# EAGLE design RPiCANShield (EAGLE 6.5.0)
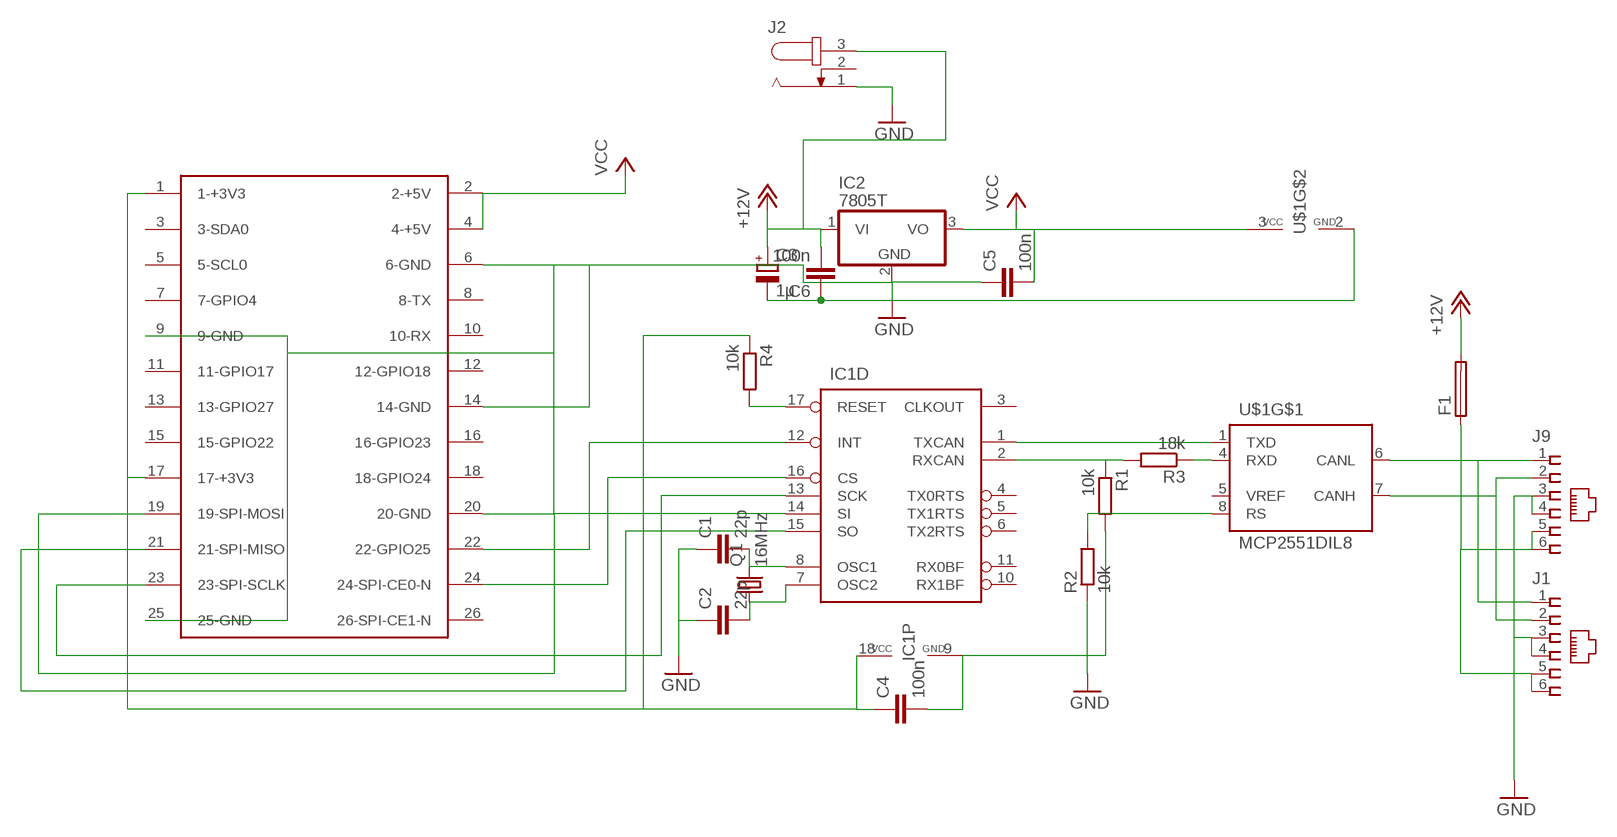
[diagram p0: schematic, sheet 1]

## Parts
C1  22p  C-EU025-024X044  [C025-024X044]
C2  22p  C-EU025-024X044  [C025-024X044]
C3  1µ  CPOL-EUE2-5  [E2-5]
C4  100n  C-EU050-024X044  [C050-024X044]
C5  100n  C-EU050-024X044  [C050-024X044]
C6  100n  C-EU050-024X044  [C050-024X044]
F1  PICOFUSE  [PICOFUSE]
IC1  MCP2515P  [DIL18]
IC2  7805T  [TO220H]
J1  520250-3  [520250-3]
J2  JACK-PLUG0  [SPC4077]
J9  520250-3  [520250-3]
Q1  16MHz  CRYSTALHC18U-V  [HC18U-V]
R1  10k  R-EU_0207/7  [0207/7]
R2  10k  R-EU_0207/7  [0207/7]
R3  18k  R-EU_0207/7  [0207/7]
R4  10k  R-EU_0204/5  [0204/5]
U$1  MCP2551DIL8  [DIL08]
U$2  RASPBERRY-PI  [RASPBERRY-PI]

## Nets
+12V: C3.+ C6.2 F1.2 IC2.1(VI) J2.3
GND: C1.1 C2.1 C3.- C4.2 C5.1 C6.1 IC1.9(P:GND) IC2.2(GND) J1.3 J1.4 J2.1 J9.3 J9.4 R1.2 R2.1 U$1.2(GND) U$2.6(6-GND) U$2.9(9-GND) U$2.14(14-GND) U$2.20(20-GND) U$2.25(25-GND)
N$1: IC1.1(D:TXCAN) U$1.1(TXD)
N$2: R3.1 U$1.4(RXD)
N$3: J1.1 J9.1 U$1.6(CANL)
N$4: J1.2 J9.2 U$1.7(CANH)
N$5: F1.1 J1.5 J1.6 J9.5 J9.6
N$6: IC1.2(D:RXCAN) R1.1 R3.2
N$7: R2.2 U$1.8(RS)
N$8: C4.1 IC1.18(P:VCC) R4.1 U$2.1(1-+3V3) U$2.17(17-+3V3)
N$10: IC1.17(D:RESET) R4.2
N$11: IC1.16(D:CS) U$2.24(24-SPI-CE0-N)
N$12: IC1.13(D:SCK) U$2.23(23-SPI-SCLK)
N$13: IC1.14(D:SI) U$2.19(19-SPI-MOSI)
N$14: IC1.12(D:INT) U$2.22(22-GPIO25)
N$16: IC1.15(D:SO) U$2.21(21-SPI-MISO)
N$22: C1.2 IC1.8(D:OSC1) Q1.2
N$23: C2.2 IC1.7(D:OSC2) Q1.1
VCC: C5.2 IC2.3(VO) U$1.3(VCC) U$2.2(2-+5V) U$2.4(4-+5V)
Unconnected: IC1.3(D:CLKOUT) IC1.4(D:TX0RTS) IC1.5(D:TX1RTS) IC1.6(D:TX2RTS) IC1.10(D:RX1BF) IC1.11(D:RX0BF) J2.2 U$1.5(VREF) U$2.3(3-SDA0) U$2.5(5-SCL0) U$2.7(7-GPIO4) U$2.8(8-TX) U$2.10(10-RX) U$2.11(11-GPIO17) U$2.12(12-GPIO18) U$2.13(13-GPIO27) U$2.15(15-GPIO22) U$2.16(16-GPIO23) U$2.18(18-GPIO24) U$2.26(26-SPI-CE1-N)

## Library data of the parts
C1 C2 = resistor:C-EU: CAPACITOR, European symbol
C3 = resistor:CPOL-EU: POLARIZED CAPACITOR, European symbol
C4-C6 = rcl:C-EU: CAPACITOR, European symbol
F1 = fuse:PICOFUSE: PICOFUSE 19275, Wickmann; OC_FARNELL: unknown; OC_NEWARK: unknown
IC1 = can:MCP2515: MC2515 Stand-Alone CAN Controller With SPI Interface, Microchip
IC2 = linear:78*: Positive VOLTAGE REGULATOR Source: http://cache.national.com/ds/LM/LM78L05.pdf http://www.fairchildsemi.com/ds/LM/LM7805.pdf
J1 J9 = con-amp:520250-3: AMP connector
J2 = con-jack:JACK-PLUG: DC POWER JACK Power Jack, DC, Right Angle, Through Hole, Rated 5A at 16VDC, PC Terminals Distributor: Farnell (www.Farnell.de) Drawing: 84N1161.pdf / 84N1162.pdf Manufacturer: SPC Technology (www.spctechnology.com) Type: SPC4077 / SPC 4078; OC_FARNELL: unknown; OC_NEWARK: unknown
Q1 = crystal:CRYSTAL: CRYSTAL; OC_FARNELL: unknown; OC_NEWARK: unknown
R1-R4 = resistor:R-EU_: RESISTOR, European symbol
U$1 = can:MCP2551: CAN Tranceiver Microchip
U$2 = RaspberryPi:RASPBERRY-PI: Raspberry Pi Board <http://www.raspberrypi.org/> Jacques Lagnel V1.0 (beta) 2012 Board dimension: Forum 3D model <http://www.raspberrypi.org/forum/general-discussion/mechanical-profile-3d-models?value=3d%20model&type=1&include=1&search=1&ret=all> The GPIO Connector (P1): http://elinux.org/RPi_Low-level_peripherals

## Board
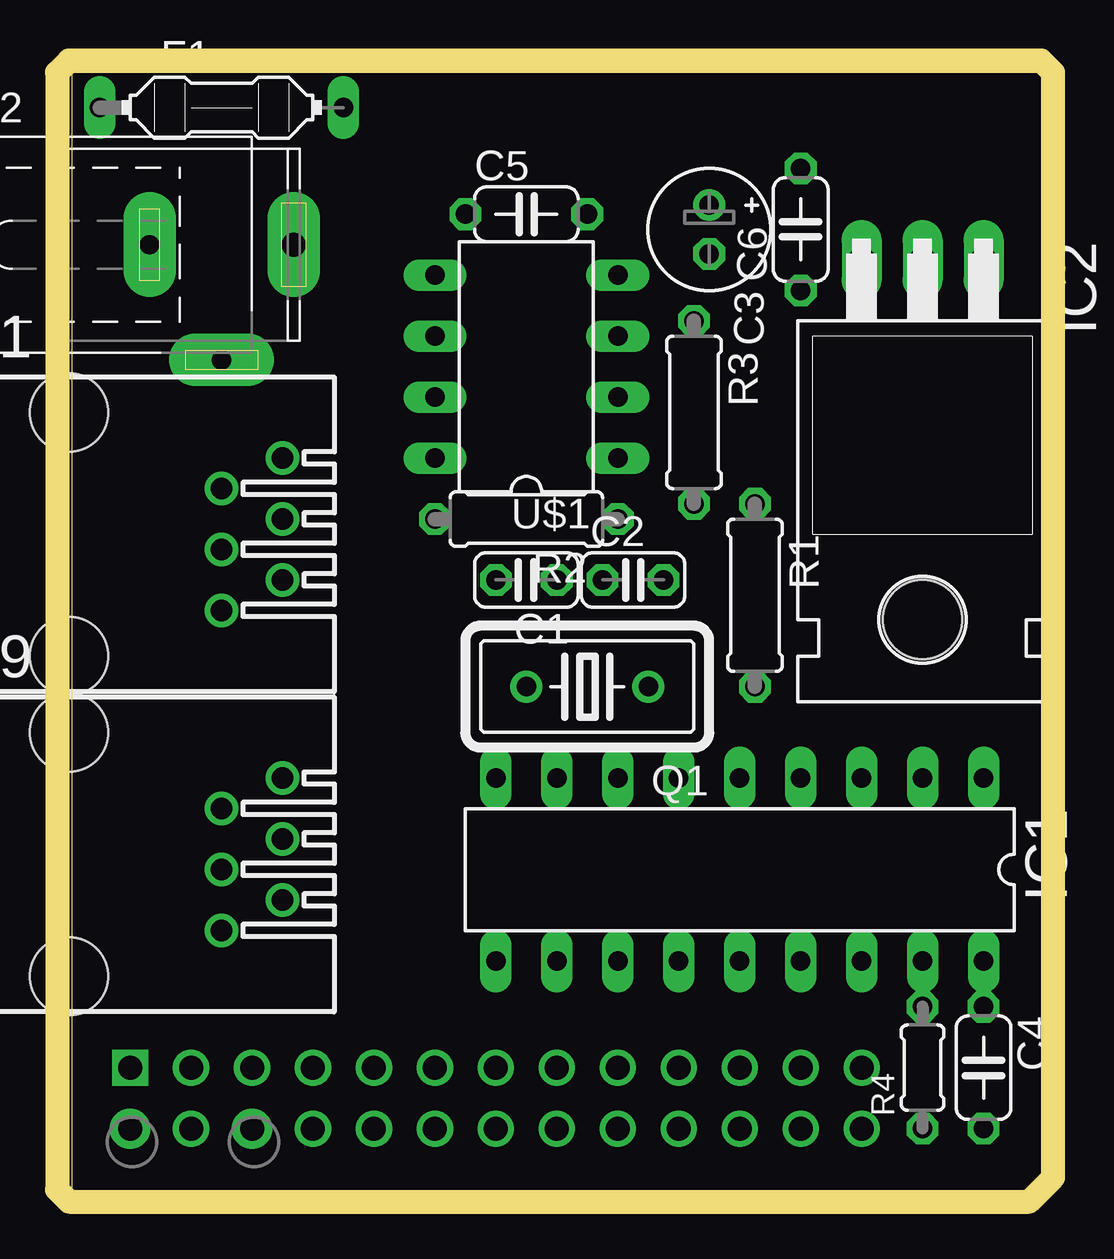
[diagram p1: board, top side]
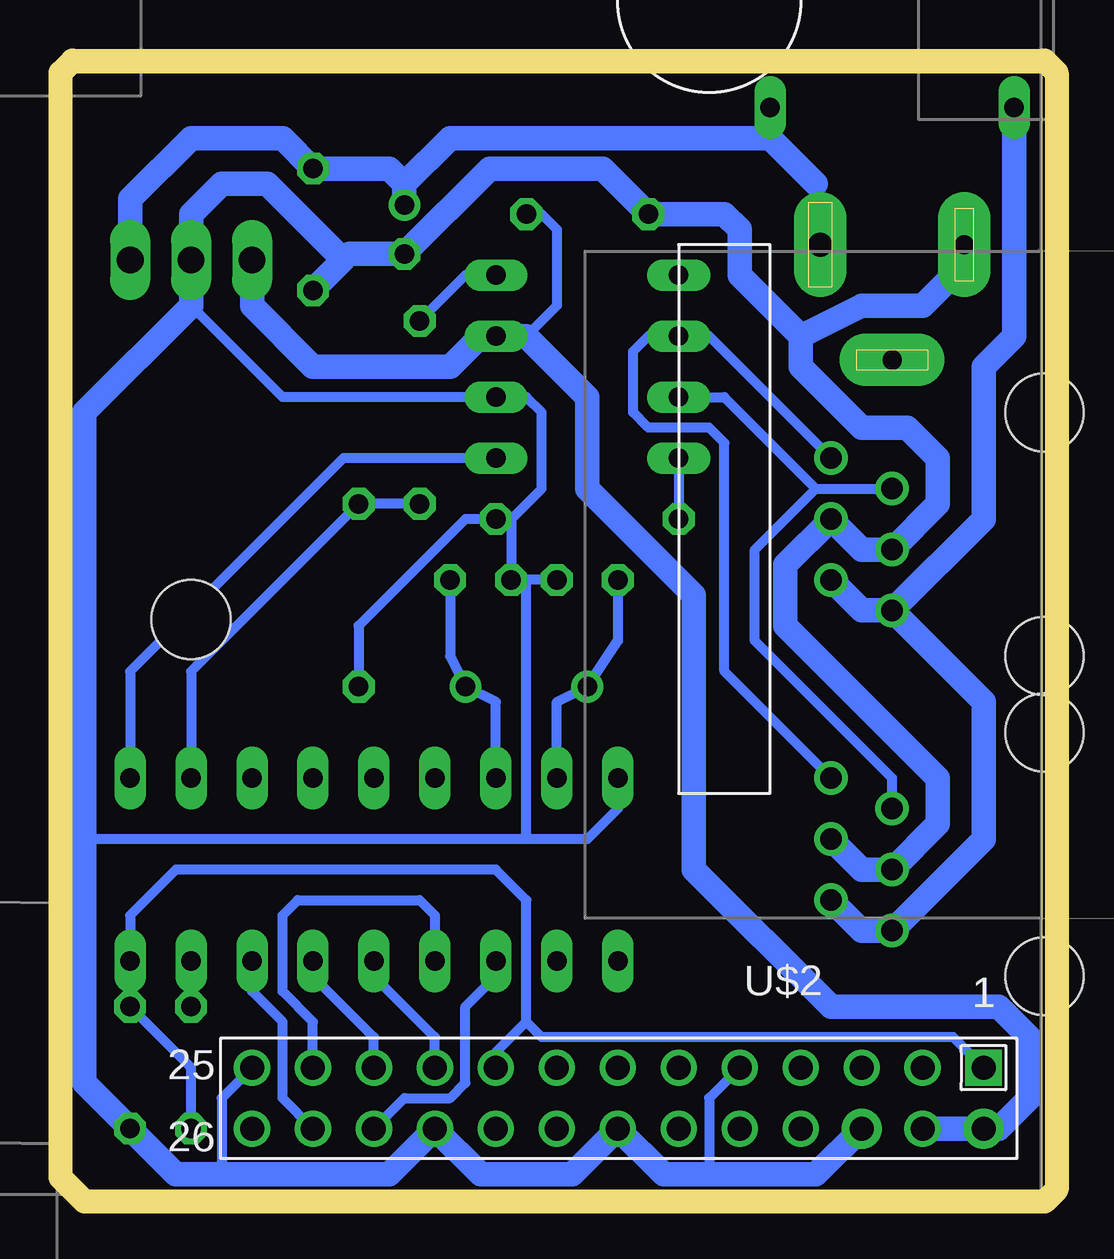
[diagram p2: board, bottom side, seen from below]

Size 40.5 x 46.81 mm. Coordinates in mm from the lower left corner, seen from the top.
Outline: 0,0 40.5,0 40.5,46.81 0,46.81 0,0
Copper layers (1*16): Top 0.035mm / dielectric 1.5mm / Bottom 0.035mm
Design rules "default *": minimum track width 10mil, minimum drill 0.6mm, track to track 8mil, track to pad 8mil, pad to pad 8mil, via to via 8mil, smd to smd 8mil, copper to edge 0mil, drill to drill 8mil, minimum pad ring 10mil, minimum via ring 8mil, stop-mask expansion 4mil, vias tented up to drill 0mil, thermal gap 10mil
Milling: 8 lines

### Footprints (pad centres in the part's own frame; a part is rotated, then mirrored left to right if it is on the bottom)
C025-024X044 = drill 0.813 octagon: 1 -1.27,0; 2 1.27,0
E2-5 = drill 0.813 pad 1.27: + -1.016,0 | drill 0.813 pad 1.27 octagon: - 1.016,0
C050-024X044 = drill 0.813 octagon: 1 -2.54,0; 2 2.54,0
PICOFUSE = drill 0.813 long: 1 -5.08,0; 2 5.08,0
DIL18 = drill 0.813 long: 1 -10.16,-3.81; 2 -7.62,-3.81; 3 -5.08,-3.81; 4 -2.54,-3.81; 5 0,-3.81; 6 2.54,-3.81; 7 5.08,-3.81; 8 7.62,-3.81; 9 10.16,-3.81; 10 10.16,3.81; 11 7.62,3.81; 12 5.08,3.81; 13 2.54,3.81; 14 0,3.81; 15 -2.54,3.81; 16 -5.08,3.81; 17 -7.62,3.81; 18 -10.16,3.81
TO220H = drill 1.118 long: 1 -2.54,-10.16; 2 0,-10.16; 3 2.54,-10.16 | hole 3.302: 0,4.826
520250-3 = drill 0.889: 1 -3.175,8.89; 2 -1.905,6.35; 3 -0.635,8.89; 4 0.635,6.35; 5 1.905,8.89; 6 3.175,6.35 | hole 3.251: -5.08,0; 5.08,0
SPC4077 = drill 0.8 pad 2.184 long: 1 -3,0; 2 0,-4.8 | drill 1 pad 2.184 long: 3 3,0
HC18U-V = drill 0.813: 1 -2.54,0; 2 2.54,0
0207/7 = drill 0.813 octagon: 1 -3.81,0; 2 3.81,0
0204/5 = drill 0.813 octagon: 1 -2.54,0; 2 2.54,0
DIL08 = drill 0.813 long: 1 -3.81,-3.81; 2 -1.27,-3.81; 3 1.27,-3.81; 4 3.81,-3.81; 5 3.81,3.81; 6 1.27,3.81; 7 -1.27,3.81; 8 -3.81,3.81
RASPBERRY-PI = drill 1 square: 1 0,0 | drill 1 pad 1.676: 2 0,2.54; 6 5.08,2.54 | drill 1: 3 2.54,0; 4 2.54,2.54; 5 5.08,0; 7 7.62,0; 8 7.62,2.54; 9 10.16,0; 10 10.16,2.54; 11 12.7,0; 12 12.7,2.54; 13 15.24,0; 14 15.24,2.54; 15 17.78,0; 16 17.78,2.54; 17 20.32,0; 18 20.32,2.54; 19 22.86,0; 20 22.86,2.54; 21 25.4,0; 22 25.4,2.54; 23 27.94,0; 24 27.94,2.54; 25 30.48,0; 26 30.48,2.54

### Placement (x,y rotation side)
C1  18.94,25.67 180 top
C2  23.39,25.67 0 top
C3  26.56,40.28 270 top
C4  37.99,5.35 270 top
C5  18.94,40.91 0 top
C6  30.37,40.28 90 top
F1  6.24,45.36 0 top
IC1  27.83,13.61 180 top
IC2  35.45,28.84 180 top
J1  -0.11,27.57 270 top
J2  6.24,39.64 0 top
J9  -0.11,14.24 270 top
Q1  21.48,21.22 180 top
R1  28.46,25.04 270 top
R2  18.94,28.21 180 top
R3  25.93,32.66 270 top
R4  35.45,5.35 90 top
U$1  18.94,34.56 90 top
U$2  2.43,5.35 180 bottom

### Tracks (layer width: path | path; a pad name or v marks a point on that pad's centre or on a via)
+12V
  Bottom 0.406: 9.42,42.18 9.42,39.82 J2.3 | IC2.1 37.99,40.28
  Bottom 1.016: 26.56,42.18 24.66,44.09 11.32,44.09 | 11.32,44.09 9.42,42.18 | C3.+ 26.56,42.18 | 26.56,42.18 27.2,42.82 C6.2 31.64,44.09 35.45,44.09 37.99,41.55 37.99,40.28 | 11.32,44.09 F1.2
GND
  Bottom 0.406: U$2.25 34.18,4.08 34.18,0.91 | C1.1 21.48,25.67 | 21.48,25.67 C2.1 22.12,28.21 | IC1.9 17.67,16.14 18.94,14.88 21.48,14.88 | 21.48,14.88 39.9,14.88 | 21.48,14.88 21.48,25.67 | U$2.9 13.86,4.08 13.86,0.91 | 22.12,28.21 R2.1 24.02,28.21 28.46,23.77 R1.2 | 22.12,28.21 20.84,29.48 20.84,32.66 21.48,33.29 U$1.2 31.64,33.29 35.45,37.1 | 28.85,39.26 29.1,39.01
  Bottom 1.016: J9.3 7.51,13.61 J9.4 4.33,15.51 4.33,17.41 10.69,23.77 10.69,26.3 J1.3 7.51,26.94 J1.4 4.33,28.84 4.33,30.75 5.6,32.02 7.51,32.02 10.05,34.56 10.05,35.83 | U$2.6 9.42,0.91 13.86,0.91 15.77,0.91 U$2.14 19.57,0.91 23.39,0.91 U$2.20 27.2,0.91 34.18,0.91 36.09,0.91 C4.2 39.9,4.71 39.9,14.88 39.9,32.66 35.45,37.1 IC2.2 35.45,40.91 34.18,42.18 32.27,42.18 29.1,39.01 C6.1 | 28.85,39.26 C3.- 23,42.82 18.3,42.82 C5.1 13.23,40.91 12.59,40.28 12.59,38.37 10.05,35.83 | J2.1 3.24,38.83 4.97,37.1 7.51,37.1 10.05,35.83
N$1
  Bottom 0.406: U$1.1 29.1,30.75 37.99,21.86 IC1.1
N$2
  Bottom 0.406: U$1.4 24.02,38.37 R3.1
N$3
  Bottom 0.406: J1.1 13.86,35.83 U$1.6 16.4,35.83 17.04,35.2 17.04,32.66 16.4,32.02 13.86,32.02 13.23,31.38 13.23,21.86 J9.1
N$4
  Bottom 0.406: U$1.7 13.23,33.29 9.42,29.48 | 9.42,29.48 J1.2 | J9.2 6.24,17.41 11.96,23.13 11.96,26.94 9.42,29.48
N$5
  Bottom 1.016: J9.5 7.51,11.06 J9.6 2.43,14.88 2.43,20.59 J1.6 | J1.6 7.51,24.4 J1.5 | F1.1 1.16,35.83 2.43,34.56 2.43,28.21 J1.6
N$6
  Bottom 0.406: R3.2 R1.1 35.45,21.86 IC1.2
N$7
  Bottom 0.406: U$1.8 R2.2
N$8
  Bottom 0.406: U$2.1 3.7,6.62 20.84,6.62 21.48,7.26 | U$2.17 22.75,5.98 21.48,7.26 | 21.48,7.26 21.48,12.33 22.75,13.61 36.09,13.61 37.99,11.7 IC1.18 C4.1 35.45,5.35 R4.1
N$10
  Bottom 0.406: IC1.17 R4.2
N$11
  Bottom 0.406: U$2.24 31.64,4.08 31.64,7.26 32.91,8.53 IC1.16
N$12
  Bottom 0.406: U$2.23 30.37,7.26 31.64,8.53 31.64,11.7 31,12.33 25.93,12.33 25.29,11.7 IC1.13
N$13
  Bottom 0.406: U$2.19 25.29,6.62 27.83,9.16 IC1.14
N$14
  Bottom 0.406: U$2.22 26.56,4.08 24.66,4.08 24.02,4.71 24.02,7.89 22.75,9.16 IC1.12
N$16
  Bottom 0.406: U$2.21 27.83,6.62 30.37,9.16 IC1.15
N$22
  Bottom 0.406: C1.2 17.67,23.13 Q1.2 20.21,20.59 IC1.8
N$23
  Bottom 0.406: C2.2 24.66,22.5 Q1.1 22.75,20.59 IC1.7
VCC
  Bottom 0.406: C5.2 20.84,40.91 20.21,40.28 20.21,37.1 21.48,35.83 | 23.39,35.83 U$1.3
  Bottom 1.016: U$2.4 U$2.2 1.79,2.81 0.53,4.08 0.53,6.62 1.79,7.89 8.78,7.89 14.5,13.61 14.5,25.04 18.94,29.48 18.94,33.29 21.48,35.83 U$1.3 | IC2.3 32.91,37.1 30.37,34.56 24.66,34.56 23.39,35.83